# Altium project Zvezda Input Selector.PrjPCB
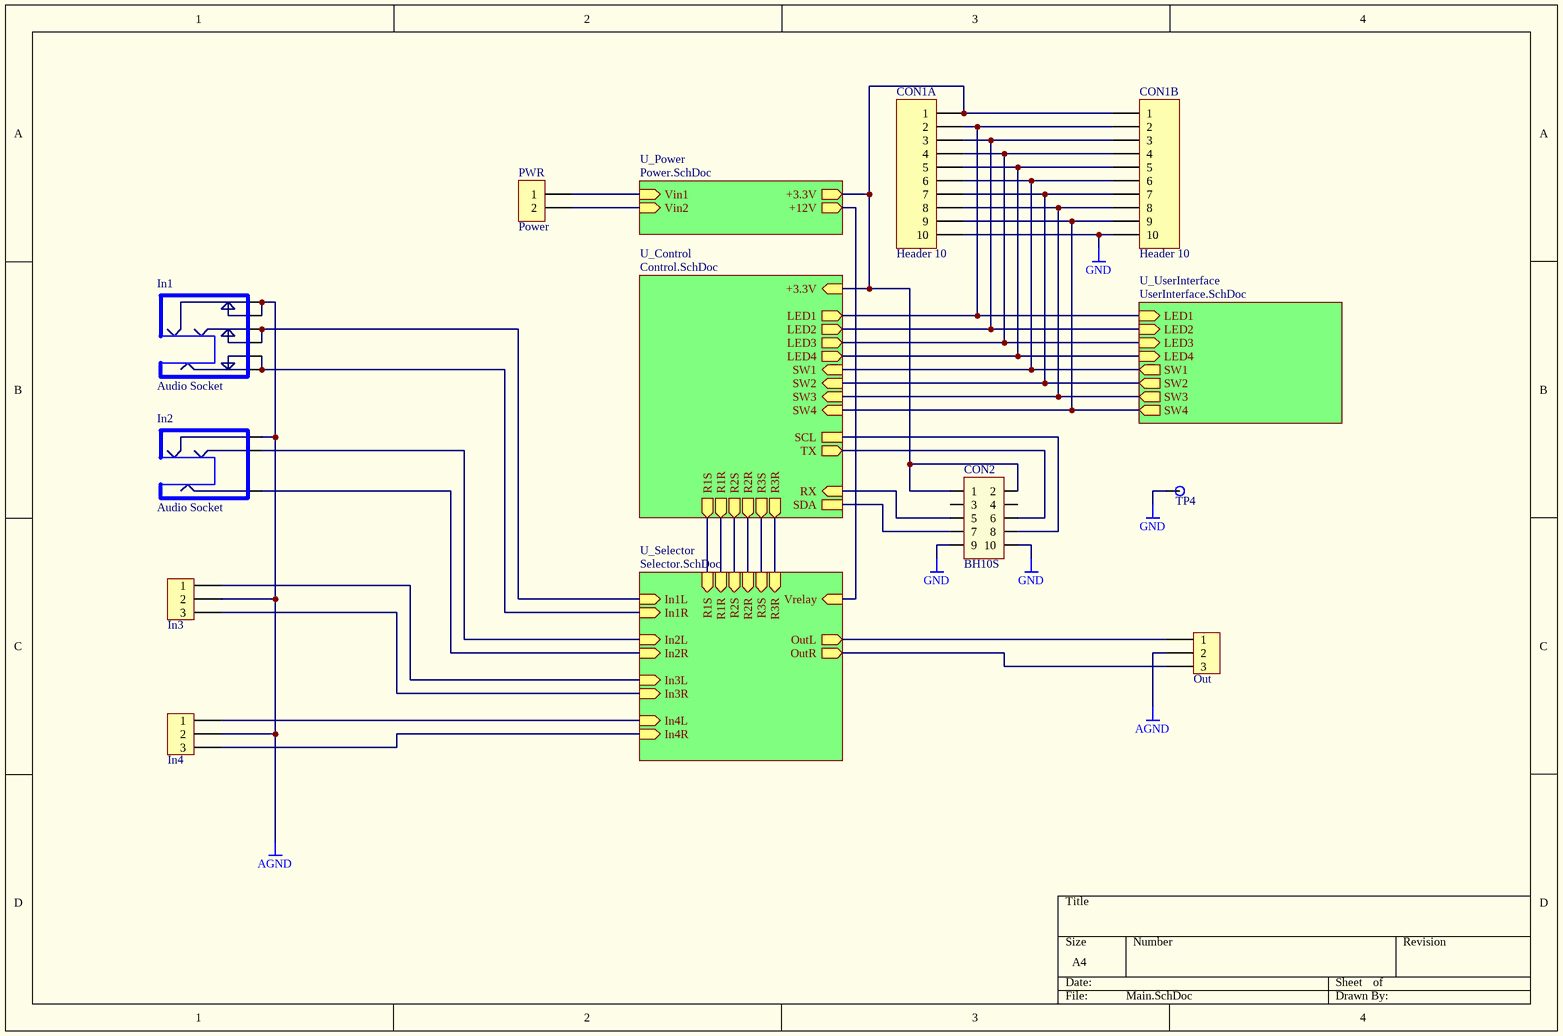
[diagram p0: Main.SchDoc]
5 sheets, 54 parts. Net scope: hierarchical (ports join the sheet entries above them; power ports are global).
Board file: ZvezdaInputSelector.PcbDoc
Sheets:
  Main.SchDoc
    U_Control = Control.SchDoc
    U_Power = Power.SchDoc
    U_Selector = Selector.SchDoc
    U_UserInterface = UserInterface.SchDoc

## Sheet Main.SchDoc
size A4

### Parts
CON1A  Header 10  [JP10]
CON1B  Header 10  [JP10]
CON2  BH10S  [BH10S]
In1  Audio Socket  [Schurter4803.2330]
In2  Audio Socket  [MULTICOMP-MJ4435-R]
In3  CON3  [CON_WS03S]  (value not drawn)
In4  CON3  [CON_WS03S]  (value not drawn)
Out  CON3  [CON_WS03S]  (value not drawn)
PWR  Power  [CONN_TOP_2P]
TP4  TESTPAD  [MISC_PAD-36/65]  (value not drawn)

### Sub-sheets
U_Control = Control.SchDoc: SDA, SCL, TX (out), RX (in), +3.3V (in), R1S (out), R1R (out), R2S (out), R2R (out), R3S (out), R3R (out), LED1 (out), LED2 (out), LED3 (out), LED4 (out), SW1 (in), SW2 (in), SW3 (in), SW4 (in)
U_Power = Power.SchDoc: Vin1 (in), Vin2 (in), +12V (out), +3.3V (out)
U_Selector = Selector.SchDoc: In1L (in), In2L (in), In3L (in), In4L (in), In1R (in), In2R (in), In3R (in), In4R (in), OutL (out), OutR (out), Vrelay (in), R3R (in), R2S (in), R1R (in), R1S (in), R2R (in), R3S (in)
U_UserInterface = UserInterface.SchDoc: SW1 (out), SW2 (out), SW3 (out), SW4 (out), LED1 (in), LED2 (in), LED3 (in), LED4 (in)

### Nets
3.3V: CON1A.1 CON1B.1 CON2.1 CON2.2 ; sheet U_Control/+3.3V, sheet U_Power/+3.3V
AGND: In1.3(GND) In1.4(GND) In2.1(GND) In3.2 In4.2 Out.2
GND: CON1A.10 CON1B.10 CON2.9 CON2.10 TP4.1
RX: CON2.5 ; sheet U_Control/RX
SCL: CON2.8 ; sheet U_Control/SCL
SDA: CON2.7 ; sheet U_Control/SDA
TX: CON2.6 ; sheet U_Control/TX
NetBUT1_2: CON1A.6 CON1B.6 ; sheet U_Control/SW1, sheet U_UserInterface/SW1
NetBUT2_2: CON1A.7 CON1B.7 ; sheet U_Control/SW2, sheet U_UserInterface/SW2
NetBUT3_2: CON1A.8 CON1B.8 ; sheet U_Control/SW3, sheet U_UserInterface/SW3
NetBUT4_2: CON1A.9 CON1B.9 ; sheet U_Control/SW4, sheet U_UserInterface/SW4
NetC8_1: sheet U_Power/+12V, sheet U_Selector/Vrelay
NetCON1A_2: CON1A.2 CON1B.2 ; sheet U_Control/LED1, sheet U_UserInterface/LED1
NetCON1A_3: CON1A.3 CON1B.3 ; sheet U_Control/LED2, sheet U_UserInterface/LED2
NetCON1A_4: CON1A.4 CON1B.4 ; sheet U_Control/LED3, sheet U_UserInterface/LED3
NetCON1A_5: CON1A.5 CON1B.5 ; sheet U_Control/LED4, sheet U_UserInterface/LED4
NetD2_1: PWR.1 ; sheet U_Power/Vin1
NetD2_2: PWR.2 ; sheet U_Power/Vin2
NetIn1_1: In1.1(L) In1.6(L) ; sheet U_Selector/In1L
NetIn1_2: In1.2(R) In1.5(R) ; sheet U_Selector/In1R
NetIn2_2: In2.2(R) ; sheet U_Selector/In2R
NetIn2_3: In2.3(L) ; sheet U_Selector/In2L
NetIn3_1: In3.1 ; sheet U_Selector/In3L
NetIn3_3: In3.3 ; sheet U_Selector/In3R
NetIn4_1: In4.1 ; sheet U_Selector/In4L
NetIn4_3: In4.3 ; sheet U_Selector/In4R
NetOut_1: Out.1 ; sheet U_Selector/OutL
NetOut_3: Out.3 ; sheet U_Selector/OutR
NetU1_2: sheet U_Control/R3R, sheet U_Selector/R3R
NetU1_3: sheet U_Control/R3S, sheet U_Selector/R3S
NetU1_4: sheet U_Control/R2S, sheet U_Selector/R2S
NetU1_5: sheet U_Control/R2R, sheet U_Selector/R2R
NetU1_6: sheet U_Control/R1R, sheet U_Selector/R1R
NetU1_7: sheet U_Control/R1S, sheet U_Selector/R1S

Not connected (* = marked no-connect by the designer): CON2 3 4

### Library data of the parts
CON1A CON1B = Header 10: Header, 10-Pin; Manufacturer: Generic Components; Class: Connector
CON2 = CON2x5: BH10S-side mounted
In1 = SOCKET_AUDIO_3WAY_SW
In2 = SOCKET_AUDIO_3WAY_NOSW
In3 In4 Out = CON3: Connector
PWR = CON2: Connector

## Sheet Control.SchDoc
size A4
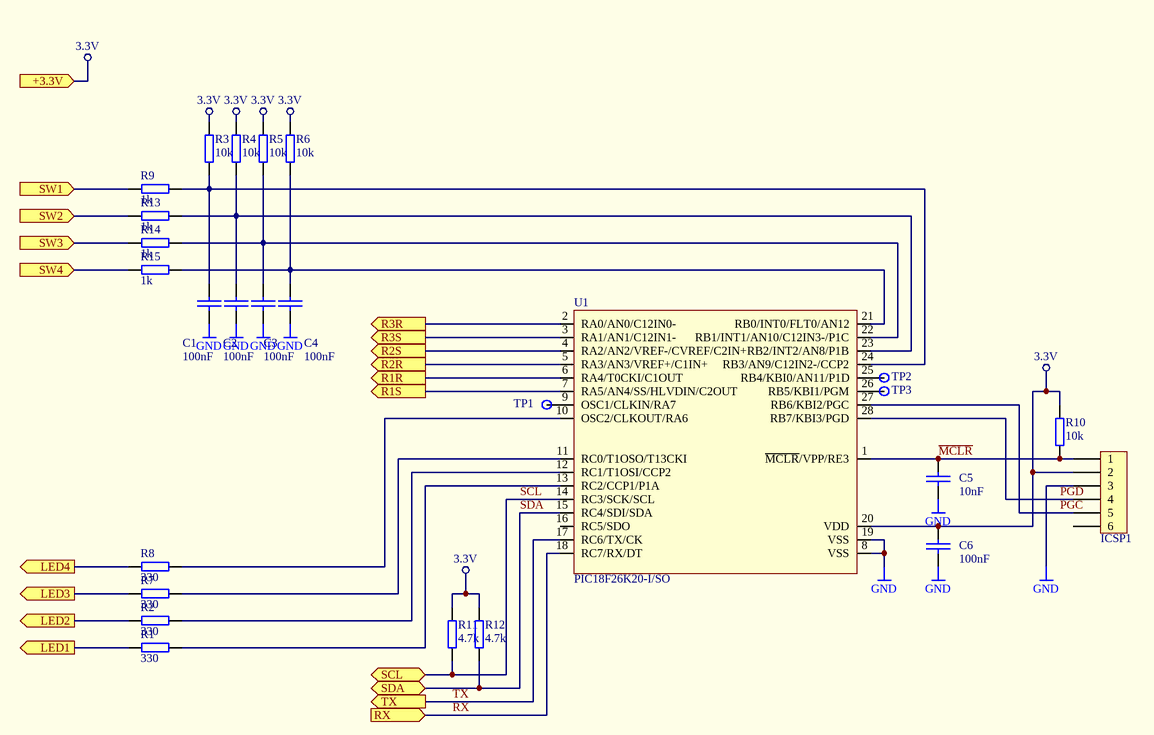
[diagram p1: Control.SchDoc]

### Parts
C1  100nF  [0805_1]
C2  100nF  [0805_1]
C3  100nF  [0805_1]
C4  100nF  [0805_1]
C5  10nF  [0805_1]
C6  100nF  [0805_1]
ICSP1  CON6  [JP6]  (value not drawn)
R1  330  [0805_1]
R2  330  [0805_1]
R3  10k  [0805_1]
R4  10k  [0805_1]
R5  10k  [0805_1]
R6  10k  [0805_1]
R7  330  [0805_1]
R8  330  [0805_1]
R9  1k  [0805_1]
R10  10k  [0805_1]
R11  4.7k  [0805_1]
R12  4.7k  [0805_1]
R13  1k  [0805_1]
R14  1k  [0805_1]
R15  1k  [0805_1]
TP1  TESTPAD  [PAD-36/65]  (value not drawn)
TP2  TESTPAD  [PAD-36/65]  (value not drawn)
TP3  TESTPAD  [PAD-36/65]  (value not drawn)
U1  PIC18F26K20-I/SO  [SOIC-28]

### Ports
+3.3V (in), LED1 (out), LED2 (out), LED3 (out), LED4 (out), R1R (out), R1S (out), R2R (out), R2S (out), R3R (out), R3S (out), RX (in), SCL, SDA, SW1 (in), SW2 (in), SW3 (in), SW4 (in), TX (out)

### Nets
3.3V: C6.1 ICSP1.2 R3.2 R4.2 R5.2 R6.2 R10.2 R11.2 R12.2 U1.20(VDD) ; port +3.3V
GND: C1.2 C2.2 C3.2 C4.2 C5.2 C6.2 ICSP1.3 U1.8(VSS) U1.19(VSS)
~{MCLR}: C5.1 ICSP1.1 R10.1 U1.1(~{MCLR}/VPP/RE3)
PGC: ICSP1.5 U1.27(RB6/KBI2/PGC)
PGD: ICSP1.4 U1.28(RB7/KBI3/PGD)
RX: U1.18(RC7/RX/DT) ; port RX
SCL: R11.1 U1.14(RC3/SCK/SCL) ; port SCL
SDA: R12.1 U1.15(RC4/SDI/SDA) ; port SDA
TX: U1.17(RC6/TX/CK) ; port TX
NetBUT1_2: R9.2 ; port SW1
NetBUT2_2: R13.2 ; port SW2
NetBUT3_2: R14.2 ; port SW3
NetBUT4_2: R15.2 ; port SW4
NetC1_1: C1.1 R3.1 R9.1 U1.24(RB3/AN9/C12IN2-/CCP2)
NetC2_1: C2.1 R4.1 R13.1 U1.23(RB2/INT2/AN8/P1B)
NetC3_1: C3.1 R5.1 R14.1 U1.22(RB1/INT1/AN10/C12IN3-/P1C)
NetC4_1: C4.1 R6.1 R15.1 U1.21(RB0/INT0/FLT0/AN12)
NetCON1A_2: R1.1 ; port LED1
NetCON1A_3: R2.1 ; port LED2
NetCON1A_4: R7.1 ; port LED3
NetCON1A_5: R8.1 ; port LED4
NetR1_2: R1.2 U1.13(RC2/CCP1/P1A)
NetR2_2: R2.2 U1.12(RC1/T1OSI/CCP2)
NetR7_2: R7.2 U1.11(RC0/T1OSO/T13CKI)
NetR8_2: R8.2 U1.10(OSC2/CLKOUT/RA6)
NetTP1_1: TP1.1 U1.9(OSC1/CLKIN/RA7)
NetTP2_1: TP2.1 U1.25(RB4/KBI0/AN11/P1D)
NetTP3_1: TP3.1 U1.26(RB5/KBI1/PGM)
NetU1_2: U1.2(RA0/AN0/C12IN0-) ; port R3R
NetU1_3: U1.3(RA1/AN1/C12IN1-) ; port R3S
NetU1_4: U1.4(RA2/AN2/VREF-/CVREF/C2IN+) ; port R2S
NetU1_5: U1.5(RA3/AN3/VREF+/C1IN+) ; port R2R
NetU1_6: U1.6(RA4/T0CKI/C1OUT) ; port R1R
NetU1_7: U1.7(RA5/AN4/SS/HLVDIN/C2OUT) ; port R1S

Not connected (* = marked no-connect by the designer): ICSP1 6; U1 16(RC5/SDO)

### Library data of the parts
C1-C6 = CAP: Capacitor
ICSP1 = CON6: Connector
R1-R15 = RES: Resistor
U1 = PIC18F26K20-I/SO: PIC18 mid-range mcu

## Sheet Power.SchDoc
size A4
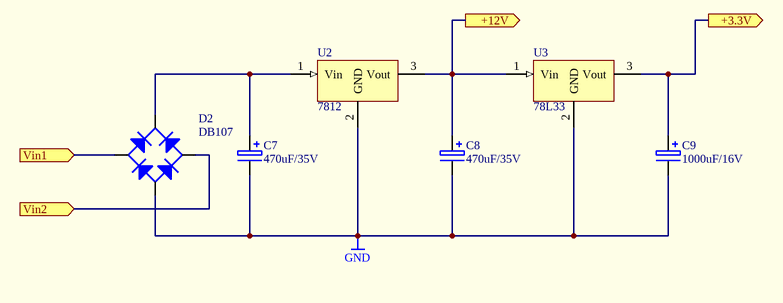
[diagram p2: Power.SchDoc]

### Parts
C7  470uF/35V  [EC10x20]
C8  470uF/35V  [EC8x16]
C9  1000uF/16V  [EC6.3x12]
D2  DB107  [BRIDGE_PTH]
U2  7812  [TO-220-V]
U3  78L33  [IC_TO-92]

### Ports
+3.3V (out), +12V (out), Vin1 (in), Vin2 (in)

### Nets
3.3V: C9.1 U3.3(Vout) ; port +3.3V
GND: C7.2 C8.2 C9.2 D2.4(M) U2.2(GND) U3.2(GND)
NetC7_1: C7.1 D2.3(P) U2.1(Vin)
NetC8_1: C8.1 U2.3(Vout) U3.1(Vin) ; port +12V
NetD2_1: D2.1(AC1) ; port Vin1
NetD2_2: D2.2(AC2) ; port Vin2

### Library data of the parts
C7-C9 = ELECTRO1: Electrolytic Capacitor
D2 = BRIDGE
U2 U3 = 78XX

## Sheet Selector.SchDoc
size A4
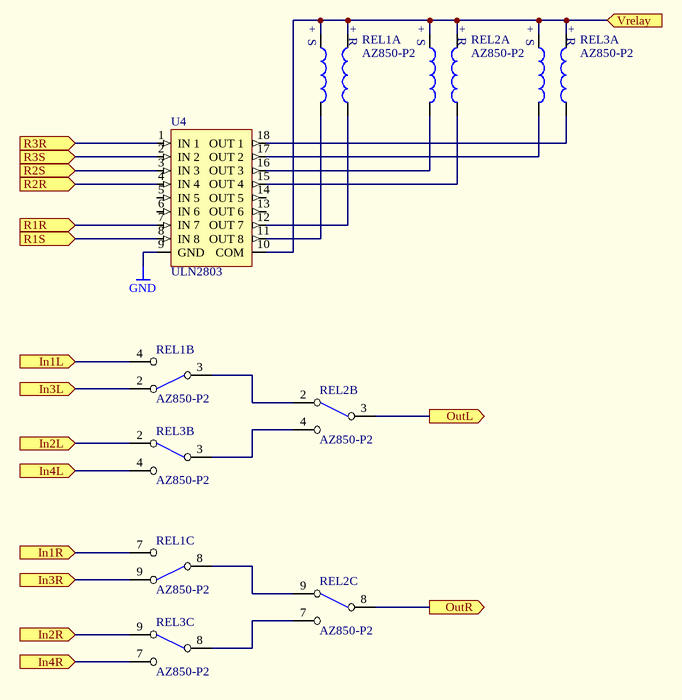
[diagram p3: Selector.SchDoc]

### Parts
REL1  AZ850-P2  [RELAY_AZ850]  (parts A,B,C of 3)
REL2  AZ850-P2  [RELAY_AZ850]  (parts A,B,C of 3)
REL3  AZ850-P2  [RELAY_AZ850]  (parts A,B,C of 3)
U4  ULN2803  [IC_SOIC-18]

### Ports
In1L (in), In1R (in), In2L (in), In2R (in), In3L (in), In3R (in), In4L (in), In4R (in), OutL (out), OutR (out), R1R (in), R1S (in), R2R (in), R2S (in), R3R (in), R3S (in), Vrelay (in)

### Nets
GND: U4.9(GND)
NetC8_1: REL1.1 REL1.10 REL2.1 REL2.10 REL3.1 REL3.10 U4.10(COM) ; port Vrelay
NetIn1_1: REL1.4 ; port In1L
NetIn1_2: REL1.7 ; port In1R
NetIn2_2: REL3.9 ; port In2R
NetIn2_3: REL3.2 ; port In2L
NetIn3_1: REL1.2 ; port In3L
NetIn3_3: REL1.9 ; port In3R
NetIn4_1: REL3.4 ; port In4L
NetIn4_3: REL3.7 ; port In4R
NetOut_1: REL2.3 ; port OutL
NetOut_3: REL2.8 ; port OutR
NetREL1_3: REL1.3 REL2.2
NetREL1_5: REL1.5 U4.11(OUT_8)
NetREL1_6: REL1.6 U4.12(OUT_7)
NetREL1_8: REL1.8 REL2.9
NetREL2_4: REL2.4 REL3.3
NetREL2_5: REL2.5 U4.16(OUT_3)
NetREL2_6: REL2.6 U4.15(OUT_4)
NetREL2_7: REL2.7 REL3.8
NetREL3_5: REL3.5 U4.17(OUT_2)
NetREL3_6: REL3.6 U4.18(OUT_1)
NetU1_2: U4.1(IN_1) ; port R3R
NetU1_3: U4.2(IN_2) ; port R3S
NetU1_4: U4.3(IN_3) ; port R2S
NetU1_5: U4.4(IN_4) ; port R2R
NetU1_6: U4.7(IN_7) ; port R1R
NetU1_7: U4.8(IN_8) ; port R1S

Not connected (* = marked no-connect by the designer): U4 5(IN_5) 6(IN_6) 13(OUT_6) 14(OUT_5)

### Notes on the sheet
- (in symbol AZ850-P2, part A) +; S; R

### Library data of the parts
REL1-REL3 = AZ850-P2: bi-stable relay
U4 = ULN2803: HIGH-VOLTAGE,HIGH-CURRENT DARLINTON ARRAYS

## Sheet UserInterface.SchDoc
size A4
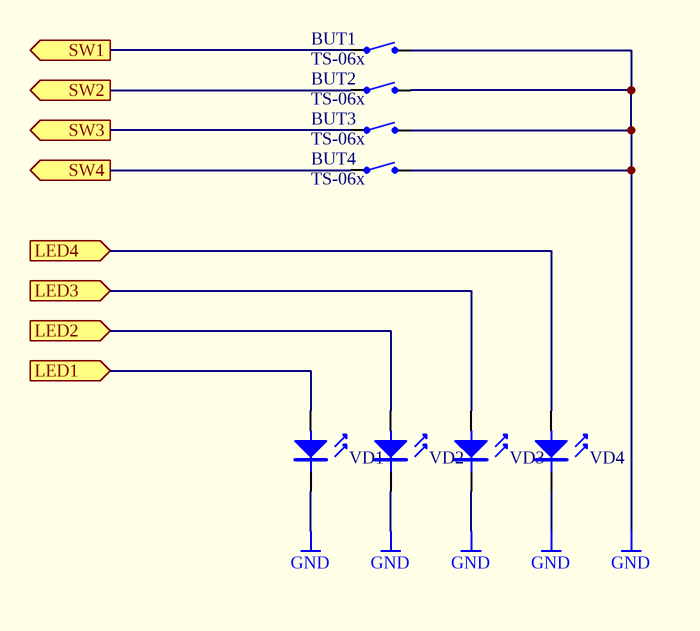
[diagram p4: UserInterface.SchDoc]

### Parts
BUT1  TS-06x  [BUT_6x6]
BUT2  TS-06x  [BUT_6x6]
BUT3  TS-06x  [BUT_6x6]
BUT4  TS-06x  [BUT_6x6]
VD1  LED  [LED_3MM]  (value not drawn)
VD2  LED  [LED_3MM]  (value not drawn)
VD3  LED  [LED_3MM]  (value not drawn)
VD4  LED  [LED_3MM]  (value not drawn)

### Ports
LED1 (in), LED2 (in), LED3 (in), LED4 (in), SW1 (out), SW2 (out), SW3 (out), SW4 (out)

### Nets
GND: BUT1.1 BUT2.1 BUT3.1 BUT4.1 VD1.2(K) VD2.2(K) VD3.2(K) VD4.2(K)
NetBUT1_2: BUT1.2 ; port SW1
NetBUT2_2: BUT2.2 ; port SW2
NetBUT3_2: BUT3.2 ; port SW3
NetBUT4_2: BUT4.2 ; port SW4
NetCON1A_2: VD1.1(A1) ; port LED1
NetCON1A_3: VD2.1(A1) ; port LED2
NetCON1A_4: VD3.1(A1) ; port LED3
NetCON1A_5: VD4.1(A1) ; port LED4

### Library data of the parts
BUT1-BUT4 = SW_TS06: Tactile push-button
VD1-VD4 = LED: LED, 3mm

## Nets that join several sheets
3.3V: Main (CON1A.1 CON1B.1 CON2.1 CON2.2), Control (10 pins), Power (C9.1 U3.3)
GND: Main (5 pins), Control (9 pins), Power (6 pins), Selector (U4.9), UserInterface (8 pins)
NetBUT1_2: Main (CON1A.6 CON1B.6), Control (R9.2), UserInterface (BUT1.2)
NetBUT2_2: Main (CON1A.7 CON1B.7), Control (R13.2), UserInterface (BUT2.2)
NetBUT3_2: Main (CON1A.8 CON1B.8), Control (R14.2), UserInterface (BUT3.2)
NetBUT4_2: Main (CON1A.9 CON1B.9), Control (R15.2), UserInterface (BUT4.2)
NetC8_1: Power (C8.1 U2.3 U3.1), Selector (7 pins)
NetCON1A_2: Main (CON1A.2 CON1B.2), Control (R1.1), UserInterface (VD1.1)
NetCON1A_3: Main (CON1A.3 CON1B.3), Control (R2.1), UserInterface (VD2.1)
NetCON1A_4: Main (CON1A.4 CON1B.4), Control (R7.1), UserInterface (VD3.1)
NetCON1A_5: Main (CON1A.5 CON1B.5), Control (R8.1), UserInterface (VD4.1)
NetD2_1: Main (PWR.1), Power (D2.1)
NetD2_2: Main (PWR.2), Power (D2.2)
NetIn1_1: Main (In1.1 In1.6), Selector (REL1.4)
NetIn1_2: Main (In1.2 In1.5), Selector (REL1.7)
NetIn2_2: Main (In2.2), Selector (REL3.9)
NetIn2_3: Main (In2.3), Selector (REL3.2)
NetIn3_1: Main (In3.1), Selector (REL1.2)
NetIn3_3: Main (In3.3), Selector (REL1.9)
NetIn4_1: Main (In4.1), Selector (REL3.4)
NetIn4_3: Main (In4.3), Selector (REL3.7)
NetOut_1: Main (Out.1), Selector (REL2.3)
NetOut_3: Main (Out.3), Selector (REL2.8)
NetU1_2: Control (U1.2), Selector (U4.1)
NetU1_3: Control (U1.3), Selector (U4.2)
NetU1_4: Control (U1.4), Selector (U4.3)
NetU1_5: Control (U1.5), Selector (U4.4)
NetU1_6: Control (U1.6), Selector (U4.7)
NetU1_7: Control (U1.7), Selector (U4.8)
RX: Main (CON2.5), Control (U1.18)
SCL: Main (CON2.8), Control (R11.1 U1.14)
SDA: Main (CON2.7), Control (R12.1 U1.15)
TX: Main (CON2.6), Control (U1.17)